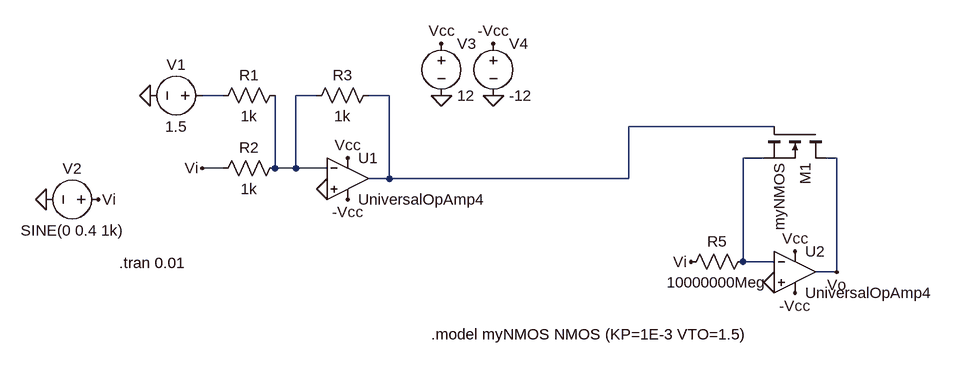
[diagram p0: schematic agc_deneme.asc]
agc_deneme.asc, the LTspice schematic file:
Version 4
SHEET 1 1156 680
WIRE 128 -32 96 -32
WIRE 272 -32 240 -32
WIRE 384 -32 352 -32
WIRE 976 16 752 16
WIRE 960 64 928 64
WIRE 1072 64 1056 64
WIRE 128 80 96 80
WIRE 208 80 208 -32
WIRE 240 80 240 -32
WIRE 240 80 208 80
WIRE 288 80 240 80
WIRE 384 96 384 -32
WIRE 384 96 352 96
WIRE 752 96 752 16
WIRE 752 96 384 96
WIRE 928 224 928 64
WIRE 976 224 928 224
WIRE 1072 240 1072 64
WIRE 1072 240 1040 240
FLAG 288 112 0
FLAG 16 -32 0
FLAG -144 128 0
FLAG 544 -32 0
FLAG 464 -32 0
FLAG 464 -112 Vcc
FLAG 544 -112 -Vcc
FLAG 320 64 Vcc
FLAG 320 128 -Vcc
FLAG -64 128 Vi
FLAG 96 80 Vi
FLAG 976 256 0
FLAG 1008 208 Vcc
FLAG 1008 272 -Vcc
FLAG 848 224 Vi
FLAG 1072 240 Vo
SYMBOL res 224 -48 R90
WINDOW 0 0 56 VBottom 2
WINDOW 3 32 56 VTop 2
SYMATTR InstName R1
SYMATTR Value 1k
SYMBOL res 224 64 R90
WINDOW 0 0 56 VBottom 2
WINDOW 3 32 56 VTop 2
SYMATTR InstName R2
SYMATTR Value 1k
SYMBOL OpAmps\\UniversalOpAmp4 320 96 R0
SYMATTR InstName U1
SYMBOL voltage 112 -32 R90
WINDOW 0 -32 56 VBottom 2
WINDOW 3 32 56 VTop 2
WINDOW 123 0 0 Left 0
WINDOW 39 0 0 Left 0
SYMATTR InstName V1
SYMATTR Value 1.5
SYMBOL voltage -48 128 R90
WINDOW 0 -32 56 VBottom 2
WINDOW 3 32 56 VTop 2
WINDOW 123 0 0 Left 0
WINDOW 39 0 0 Left 0
SYMATTR InstName V2
SYMATTR Value SINE(0 0.4 1k)
SYMBOL res 368 -48 R90
WINDOW 0 0 56 VBottom 2
WINDOW 3 32 56 VTop 2
SYMATTR InstName R3
SYMATTR Value 1k
SYMBOL voltage 464 -128 R0
WINDOW 123 0 0 Left 0
WINDOW 39 0 0 Left 0
SYMATTR InstName V3
SYMATTR Value 12
SYMBOL voltage 544 -128 R0
WINDOW 123 0 0 Left 0
WINDOW 39 0 0 Left 0
SYMATTR InstName V4
SYMATTR Value -12
SYMBOL OpAmps\\UniversalOpAmp4 1008 240 R0
SYMATTR InstName U2
SYMBOL res 944 208 R90
WINDOW 0 0 56 VBottom 2
WINDOW 3 32 56 VTop 2
SYMATTR InstName R5
SYMATTR Value 10000000Meg
SYMBOL nmos 1056 16 R90
SYMATTR InstName M1
SYMATTR Value myNMOS
TEXT -32 226 Left 2 !.tran 0.01
TEXT 448 336 Left 2 !.model myNMOS NMOS (KP=1E-3 VTO=1.5)

The netlist it stands for:
* agc_deneme.asc
R1 N002 N001 1k
R2 N002 Vi 1k
* U1: UniversalOpAmp4 (symbol OpAmps\UniversalOpAmp4 not available, pins judged from their places): In+=0 In-=N002 V+=Vcc V-=-Vcc OUT=N003
V1 N001 0 1.5
V2 Vi 0 SINE(0 0.4 1k)
R3 N003 N002 1k
V3 Vcc 0 12
V4 -Vcc 0 -12
* U2: UniversalOpAmp4 (symbol OpAmps\UniversalOpAmp4 not available, pins judged from their places): In+=0 In-=N004 V+=Vcc V-=-Vcc OUT=Vo
R5 N004 Vi 10000000Meg
M1 Vo N003 N004 N004 myNMOS
.model NMOS NMOS
.model PMOS PMOS
.lib standard.mos
.tran 0.01
.model myNMOS NMOS (KP=1E-3 VTO=1.5)
.backanno
.end